# Altium schematic sheet CAN-BUS.SchDoc: CAN Interfaces
size A3; Author: João Guimarães; Organization: Altium Limited; Address1: L3, 12a Rodborough Rd; Address2: Frenchs Forest; Address3: NSW; Address4: Australia 2086; Revision: 1.0; SheetNumber: 4; SheetTotal: 7; Version: 1.0.0; PCB: MainBoard; Project: Automotive Network EVB
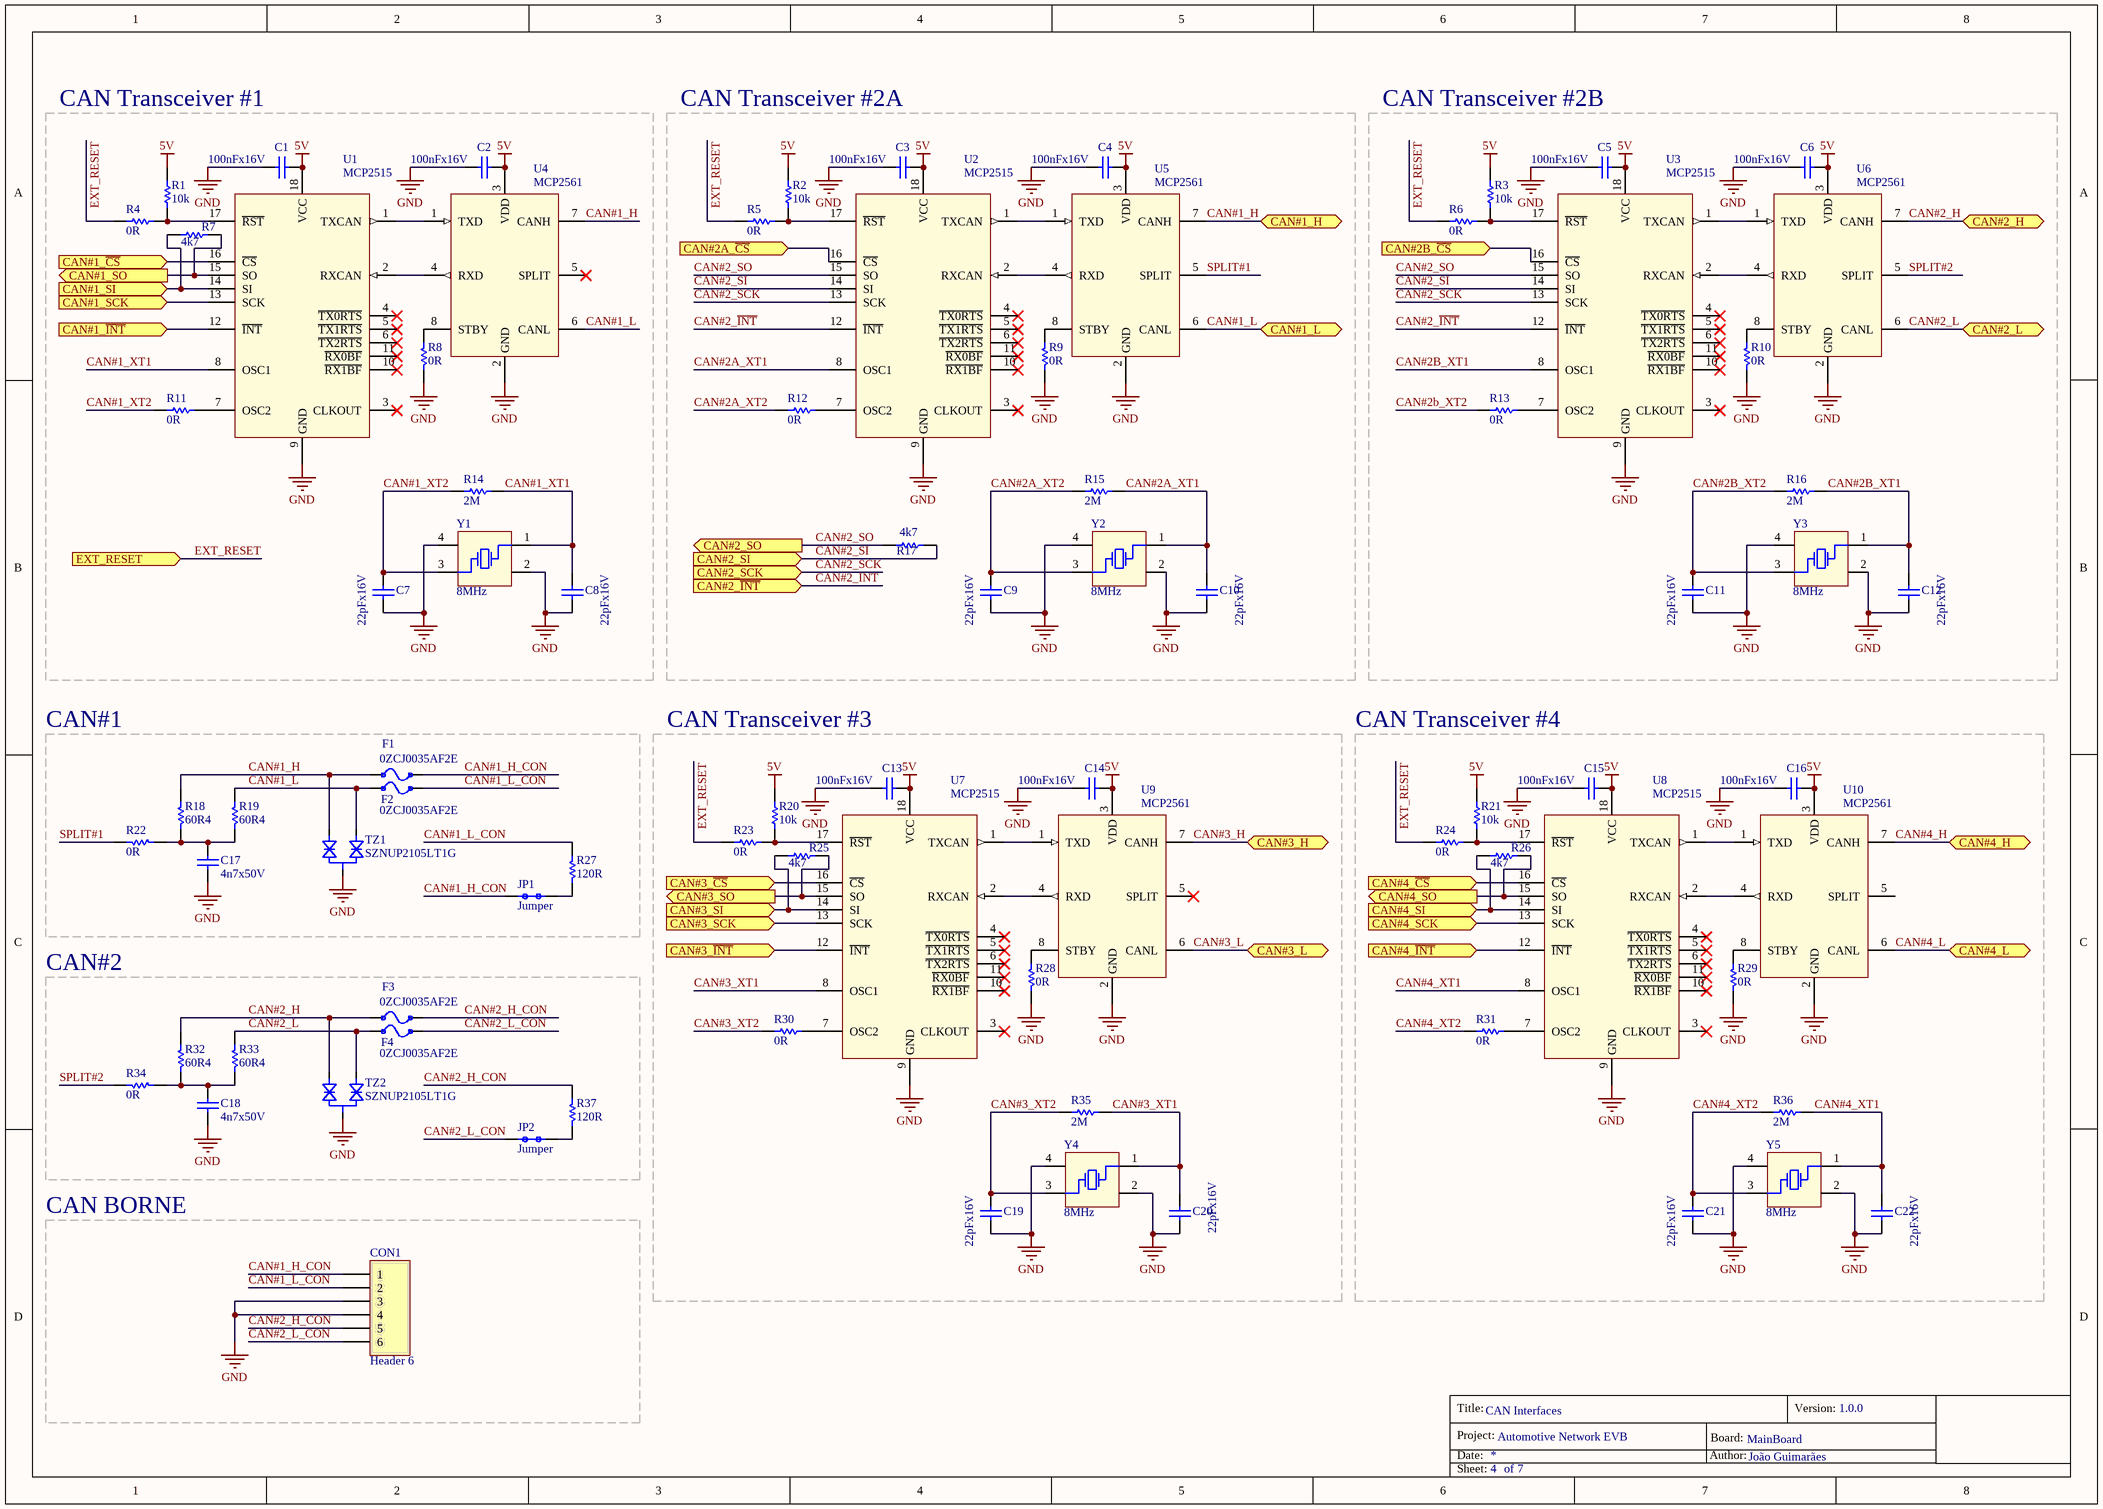
[diagram p0: CAN-BUS.SchDoc]

## Parts
C1  100nFx16V  [DISC-0603]
C2  100nFx16V  [DISC-0603]
C3  100nFx16V  [DISC-0603]
C4  100nFx16V  [DISC-0603]
C5  100nFx16V  [DISC-0603]
C6  100nFx16V  [DISC-0603]
C7  22pFx16V  [DISC-0603]
C8  22pFx16V  [DISC-0603]
C9  22pFx16V  [DISC-0603]
C10  22pFx16V  [DISC-0603]
C11  22pFx16V  [DISC-0603]
C12  22pFx16V  [DISC-0603]
C13  100nFx16V  [DISC-0603]
C14  100nFx16V  [DISC-0603]
C15  100nFx16V  [DISC-0603]
C16  100nFx16V  [DISC-0603]
C17  4n7x50V  [DISC-0603]
C18  4n7x50V  [DISC-0603]
C19  22pFx16V  [DISC-0603]
C20  22pFx16V  [DISC-0603]
C21  22pFx16V  [DISC-0603]
C22  22pFx16V  [DISC-0603]
CON1  Header 6  [CON-BORNE-6]
F1  0ZCJ0035AF2E  [DISC-FUSE-1206]
F2  0ZCJ0035AF2E  [DISC-FUSE-1206]
F3  0ZCJ0035AF2E  [DISC-FUSE-1206]
F4  0ZCJ0035AF2E  [DISC-FUSE-1206]
JP1  Jumper  [CON-HEADER-1X2-PTH]
JP2  Jumper  [CON-HEADER-1X2-PTH]
R1  10k  [DISC-0603]
R2  10k  [DISC-0603]
R3  10k  [DISC-0603]
R4  0R  [DISC-0603]
R5  0R  [DISC-0603]
R6  0R  [DISC-0603]
R7  4k7  [DISC-0603]
R8  0R  [DISC-0603]
R9  0R  [DISC-0603]
R10  0R  [DISC-0603]
R11  0R  [DISC-0603]
R12  0R  [DISC-0603]
R13  0R  [DISC-0603]
R14  2M  [DISC-0603]
R15  2M  [DISC-0603]
R16  2M  [DISC-0603]
R17  4k7  [DISC-0603]
R18  60R4  [DISC-1206]
R19  60R4  [DISC-1206]
R20  10k  [DISC-0603]
R21  10k  [DISC-0603]
R22  0R  [DISC-0603]
R23  0R  [DISC-0603]
R24  0R  [DISC-0603]
R25  4k7  [DISC-0603]
R26  4k7  [DISC-0603]
R27  120R  [DISC-1206]
R28  0R  [DISC-0603]
R29  0R  [DISC-0603]
R30  0R  [DISC-0603]
R31  0R  [DISC-0603]
R32  60R4  [DISC-1206]
R33  60R4  [DISC-1206]
R34  0R  [DISC-0603]
R35  2M  [DISC-0603]
R36  2M  [DISC-0603]
R37  120R  [DISC-1206]
TZ1  SZNUP2105LT1G  [DISC-SOT-23]
TZ2  SZNUP2105LT1G  [DISC-SOT-23]
U1  MCP2515  [CI-SOICW-18]
U2  MCP2515  [CI-SOICW-18]
U3  MCP2515  [CI-SOICW-18]
U4  MCP2561  [CI-SOIC-8]
U5  MCP2561  [CI-SOIC-8]
U6  MCP2561  [CI-SOIC-8]
U7  MCP2515  [CI-SOICW-18]
U8  MCP2515  [CI-SOICW-18]
U9  MCP2561  [CI-SOIC-8]
U10  MCP2561  [CI-SOIC-8]
Y1  8MHz  [DISC-CRYSTAL-4P-3.2X2.5]
Y2  8MHz  [DISC-CRYSTAL-4P-3.2X2.5]
Y3  8MHz  [DISC-CRYSTAL-4P-3.2X2.5]
Y4  8MHz  [DISC-CRYSTAL-4P-3.2X2.5]
Y5  8MHz  [DISC-CRYSTAL-4P-3.2X2.5]

## Blocks framed on the sheet
CAN Transceiver #1: C1 C2 C7 C8 R1 R4 R7 R8 R11 R14 U1 U4 Y1
CAN Transceiver #2A: C3 C4 C9 C10 R2 R5 R9 R12 R15 R17 U2 U5 Y2
CAN Transceiver #2B: C5 C6 C11 C12 R3 R6 R10 R13 R16 U3 U6 Y3
CAN#1: C17 F1 F2 JP1 R18 R19 R22 R27 TZ1
CAN Transceiver #3: C13 C14 C19 C20 R20 R23 R25 R28 R30 R35 U7 U9 Y4
CAN Transceiver #4: C15 C16 C21 C22 R21 R24 R26 R29 R31 R36 U8 U10 Y5
CAN#2: C18 F3 F4 JP2 R32-R34 R37 TZ2
CAN BORNE: CON1

## Ports
CAN#1_H (bidir), CAN#1_L (bidir), CAN#1_SCK (in), CAN#1_SI (in), CAN#1_SO (out), CAN#1_~{CS} (in), CAN#1_~{INT} (in), CAN#2_H (bidir), CAN#2_L (bidir), CAN#2_SCK (in), CAN#2_SI (in), CAN#2_SO (out), CAN#2_~{INT} (in), CAN#2A_~{CS} (in), CAN#2B_~{CS} (in), CAN#3_H (bidir), CAN#3_L (bidir), CAN#3_SCK (in), CAN#3_SI (in), CAN#3_SO (out), CAN#3_~{CS} (in), CAN#3_~{INT} (in), CAN#4_H (bidir), CAN#4_L (bidir), CAN#4_SCK (in), CAN#4_SI (in), CAN#4_SO (out), CAN#4_~{CS} (in), CAN#4_~{INT} (in), EXT_RESET (in)

## Nets
5V: C1.2 C2.2 C3.2 C4.2 C5.2 C6.2 C13.2 C14.2 C15.2 C16.2 R1.1 R2.1 R3.1 R20.1 R21.1 U1.18(VCC) U2.18(VCC) U3.18(VCC) U4.3(VDD) U5.3(VDD) U6.3(VDD) U7.18(VCC) U8.18(VCC) U9.3(VDD) U10.3(VDD)
GND: C1.1 C2.1 C3.1 C4.1 C5.1 C6.1 C7.1 C8.1 C9.1 C10.1 C11.1 C12.1 C13.1 C14.1 C15.1 C16.1 C17.1 C18.1 C19.1 C20.1 C21.1 C22.1 CON1.3 CON1.4 R8.1 R9.1 R10.1 R28.1 R29.1 TZ1.2(K) TZ2.2(K) U1.9(GND) U2.9(GND) U3.9(GND) U4.2(GND) U5.2(GND) U6.2(GND) U7.9(GND) U8.9(GND) U9.2(GND) U10.2(GND) Y1.2(GND) Y1.4(GND) Y2.2(GND) Y2.4(GND) Y3.2(GND) Y3.4(GND) Y4.2(GND) Y4.4(GND) Y5.2(GND) Y5.4(GND)
CAN#1_~{CS}: U1.16(~{CS}) ; port CAN#1_~{CS}
CAN#1_H: F1.1 R18.2 TZ1.1(A1) U4.7(CANH) U5.7(CANH) ; port CAN#1_H
CAN#1_H_CON: CON1.1 F1.2 JP1.1
CAN#1_~{INT}: U1.12(~{INT}) ; port CAN#1_~{INT}
CAN#1_L: F2.1 R19.2 TZ1.3(A2) U4.6(CANL) U5.6(CANL) ; port CAN#1_L
CAN#1_L_CON: CON1.2 F2.2 R27.1
CAN#1_SCK: U1.13(SCK) ; port CAN#1_SCK
CAN#1_SI: R7.2 U1.14(SI) ; port CAN#1_SI
CAN#1_SO: R7.1 U1.15(SO) ; port CAN#1_SO
CAN#1_XT1: C8.2 R14.2 U1.8(OSC1) Y1.1(OSC1)
CAN#1_XT2: C7.2 R11.2 R14.1 Y1.3(OSC2)
CAN#2_H: F3.1 R32.2 TZ2.1(A1) U6.7(CANH) ; port CAN#2_H
CAN#2_H_CON: CON1.5 F3.2 R37.1
CAN#2_~{INT}: U2.12(~{INT}) U3.12(~{INT}) ; port CAN#2_~{INT}
CAN#2_L: F4.1 R33.2 TZ2.3(A2) U6.6(CANL) ; port CAN#2_L
CAN#2_L_CON: CON1.6 F4.2 JP2.1
CAN#2_SCK: U2.13(SCK) U3.13(SCK) ; port CAN#2_SCK
CAN#2_SI: R17.1 U2.14(SI) U3.14(SI) ; port CAN#2_SI
CAN#2_SO: R17.2 U2.15(SO) U3.15(SO) ; port CAN#2_SO
CAN#2A_~{CS}: U2.16(~{CS}) ; port CAN#2A_~{CS}
CAN#2A_XT1: C10.2 R15.2 U2.8(OSC1) Y2.1(OSC1)
CAN#2A_XT2: C9.2 R12.2 R15.1 Y2.3(OSC2)
CAN#2B_~{CS}: U3.16(~{CS}) ; port CAN#2B_~{CS}
CAN#2B_XT1: C12.2 R16.2 U3.8(OSC1) Y3.1(OSC1)
CAN#2B_XT2: C11.2 R13.2 R16.1 Y3.3(OSC2)
CAN#3_~{CS}: U7.16(~{CS}) ; port CAN#3_~{CS}
CAN#3_H: U9.7(CANH) ; port CAN#3_H
CAN#3_~{INT}: U7.12(~{INT}) ; port CAN#3_~{INT}
CAN#3_L: U9.6(CANL) ; port CAN#3_L
CAN#3_SCK: U7.13(SCK) ; port CAN#3_SCK
CAN#3_SI: R25.2 U7.14(SI) ; port CAN#3_SI
CAN#3_SO: R25.1 U7.15(SO) ; port CAN#3_SO
CAN#3_XT1: C20.2 R35.2 U7.8(OSC1) Y4.1(OSC1)
CAN#3_XT2: C19.2 R30.2 R35.1 Y4.3(OSC2)
CAN#4_~{CS}: U8.16(~{CS}) ; port CAN#4_~{CS}
CAN#4_H: U10.7(CANH) ; port CAN#4_H
CAN#4_~{INT}: U8.12(~{INT}) ; port CAN#4_~{INT}
CAN#4_L: U10.6(CANL) ; port CAN#4_L
CAN#4_SCK: U8.13(SCK) ; port CAN#4_SCK
CAN#4_SI: R26.2 U8.14(SI) ; port CAN#4_SI
CAN#4_SO: R26.1 U8.15(SO) ; port CAN#4_SO
CAN#4_XT1: C22.2 R36.2 U8.8(OSC1) Y5.1(OSC1)
CAN#4_XT2: C21.2 R31.2 R36.1 Y5.3(OSC2)
EXT_RESET: R4.2 R5.2 R6.2 R23.2 R24.2 ; port EXT_RESET
SPLIT#1: R22.1 U5.5(SPLIT)
SPLIT#2: R34.1 U6.5(SPLIT)
NetC17_2: C17.2 R18.1 R19.1 R22.2
NetC18_2: C18.2 R32.1 R33.1 R34.2
NetJP1_2: JP1.2 R27.2
NetJP2_2: JP2.2 R37.2
NetR1_2: R1.2 R4.1 U1.17(~{RST})
NetR2_2: R2.2 R5.1 U2.17(~{RST})
NetR3_2: R3.2 R6.1 U3.17(~{RST})
NetR8_2: R8.2 U4.8(STBY)
NetR9_2: R9.2 U5.8(STBY)
NetR10_2: R10.2 U6.8(STBY)
NetR11_1: R11.1 U1.7(OSC2)
NetR12_1: R12.1 U2.7(OSC2)
NetR13_1: R13.1 U3.7(OSC2)
NetR20_2: R20.2 R23.1 U7.17(~{RST})
NetR21_2: R21.2 R24.1 U8.17(~{RST})
NetR28_2: R28.2 U9.8(STBY)
NetR29_2: R29.2 U10.8(STBY)
NetR30_1: R30.1 U7.7(OSC2)
NetR31_1: R31.1 U8.7(OSC2)
NetU1_1: U1.1(TXCAN) U4.1(TXD)
NetU1_2: U1.2(RXCAN) U4.4(RXD)
NetU2_1: U2.1(TXCAN) U5.1(TXD)
NetU2_2: U2.2(RXCAN) U5.4(RXD)
NetU3_1: U3.1(TXCAN) U6.1(TXD)
NetU3_2: U3.2(RXCAN) U6.4(RXD)
NetU7_1: U7.1(TXCAN) U9.1(TXD)
NetU7_2: U7.2(RXCAN) U9.4(RXD)
NetU8_1: U8.1(TXCAN) U10.1(TXD)
NetU8_2: U8.2(RXCAN) U10.4(RXD)

Not connected (* = marked no-connect by the designer): U1 3(CLKOUT)* 4(~{TX0RTS})* 5(~{TX1RTS})* 6(~{TX2RTS})* 10(~{RX1BF})* 11(~{RX0BF})*; U2 3(CLKOUT)* 4(~{TX0RTS})* 5(~{TX1RTS})* 6(~{TX2RTS})* 10(~{RX1BF})* 11(~{RX0BF})*; U3 3(CLKOUT)* 4(~{TX0RTS})* 5(~{TX1RTS})* 6(~{TX2RTS})* 10(~{RX1BF})* 11(~{RX0BF})*; U4 5(SPLIT)*; U7 3(CLKOUT)* 4(~{TX0RTS})* 5(~{TX1RTS})* 6(~{TX2RTS})* 10(~{RX1BF})* 11(~{RX0BF})*; U8 3(CLKOUT)* 4(~{TX0RTS})* 5(~{TX1RTS})* 6(~{TX2RTS})* 10(~{RX1BF})* 11(~{RX0BF})*; U9 5(SPLIT)*; U10 5(SPLIT)

## Notes on the sheet
- Title:
- Project:
- Date:
- Author:
- Board:
- Version:
- Sheet:
- of

## Library data of the parts
C1-C6 = Cap: Capacitor; Manufacturer1: Kemet; PartNumber1: C0603C104Z3VACTU; ClassName: CanBus
C7-C12 C19-C22 = Cap: Capacitor; PartNumber1: CC0603JPNPO0BN220; Manufacturer1: Yageo; ClassName: CanBus
C13-C16 = Cap: Capacitor; PartNumber1: C0603C104Z3VACTU; Manufacturer1: Kemet; ClassName: CanBus
C17 C18 = Cap: Capacitor; PartNumber1: C0603C472K5RAC7411; Manufacturer1: Kemet; ClassName: CanBus
CON1 = Header 6: Header, 3-Pin; ClassName: CanBus
F1-F4 = Fuse 1: Fuse; Manufacturer1: BelFuse; ClassName: CanBus; PartNumber1: 0ZCJ0035AF2E
JP1 JP2 = Jumper: Resistor; ClassName: CanBus
R1-R3 R20 R21 = Res: Resistor; PartNumber1: RC0603FR-0710KL; Manufacturer1: Yageo; ClassName: CanBus
R4-R6 R8-R13 R22-R24 R28-R31 R34 = Res: Resistor; PartNumber1: RC0603JR-070RL; Manufacturer1: Yageo; ClassName: CanBus
R7 R17 R25 R26 = Res: Resistor; PartNumber1: RC0603JR-074K7L; Manufacturer1: Yageo; ClassName: CanBus
R14-R16 R35 R36 = Res: Resistor; PartNumber1: RC0603FR-102ML; Manufacturer1: Yageo; ClassName: CanBus
R18 R19 R32 R33 = Res: PartNumber1: ESR18EZPF60R4; Manufacturer1: ROHM; ClassName: CanBus
R27 R37 = Res: 60R4; PartNumber1: AC1206JR-07120RL; Manufacturer1: Yageo; ClassName: CanBus
TZ1 TZ2 = TVZ-Bi-Dual: TVZ-Bi-Directional; Manufacturer1: ONSemi; ClassName: CanBus; PartNumber1: SZNUP2105LT1G
U1-U3 U7 U8 = MCP2515: Stand-Alone CAN Controller With SPI Interface; PartNumber1: MCP2515-I/SO; Manufacturer1: Microchip; ClassName: CanBus
U4-U6 U9 U10 = MCP2561: High speed CAN transceiver; PartNumber1: MCP2561T-E/SN; Manufacturer1: Microchip; ClassName: CanBus
Y1-Y5 = XTAL-4-PIN: PartNumber1: ECS-80-18-33-JGN-TR; Manufacturer1: ECS; ClassName: CanBus